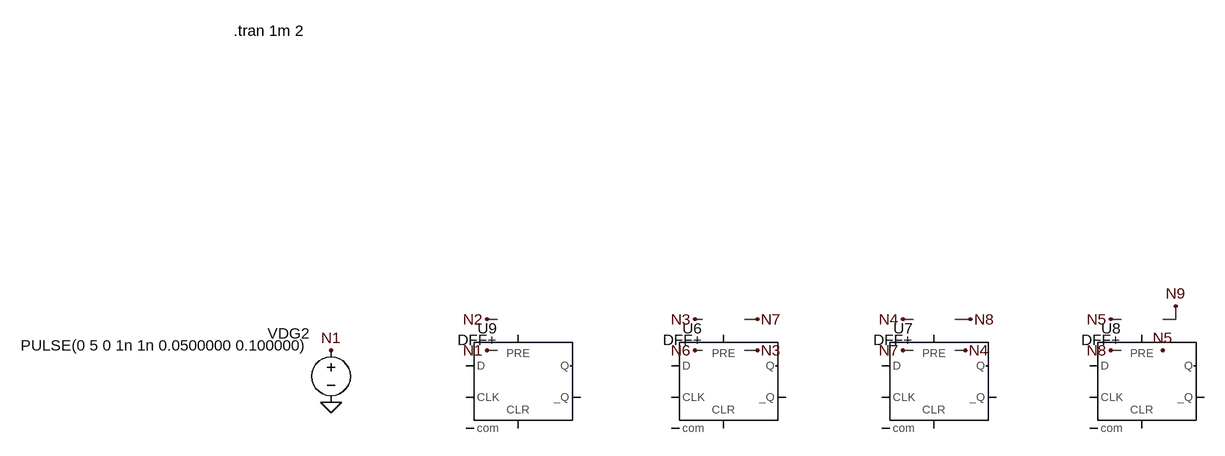
[diagram p0: schematic 6_2_1_Asynchroner_Frequenzteiler_Lsg2.asc]
6_2_1_Asynchroner_Frequenzteiler_Lsg2.asc, the LTspice schematic file:
Version 4
SHEET 1 880 680
WIRE 400 544 416 544
WIRE 816 592 796 592
WIRE 720 544 732 544
WIRE 1136 592 1120 592
WIRE 1040 544 1056 544
WIRE 1360 544 1376 544
WIRE 400 592 416 592
WIRE 720 592 732 592
WIRE 816 544 796 544
WIRE 1040 592 1056 592
WIRE 1144 544 1120 544
WIRE 1360 592 1376 592
WIRE 1440 544 1460 544
WIRE 1460 544 1460 524
FLAG 160 672 0
FLAG 400 544 N2
FLAG 816 592 N3
FLAG 720 544 N3
FLAG 1136 592 N4
FLAG 1040 544 N4
FLAG 1440 592 N5
FLAG 1360 544 N5
FLAG 160 592 N1
FLAG 400 592 N1
FLAG 720 592 N6
FLAG 816 544 N7
FLAG 1040 592 N7
FLAG 1144 544 N8
FLAG 1360 592 N8
FLAG 1460 524 N9
SYMBOL Digital\dflop 764 568 R0
WINDOW 0 -32 -10 Right 2
WINDOW 3 -32 8 Right 2
SYMATTR InstName U6
SYMATTR Value DFF+
SYMATTR LibreSpice kind=dff;edge=rising;async=high;vth=2.5;vhigh=5;pins=D,CLK,SET,RESET,Q,~Q
SYMBOL Digital\dflop 1088 568 R0
WINDOW 0 -32 -10 Right 2
WINDOW 3 -32 8 Right 2
SYMATTR InstName U7
SYMATTR Value DFF+
SYMATTR LibreSpice kind=dff;edge=rising;async=high;vth=2.5;vhigh=5;pins=D,CLK,SET,RESET,Q,~Q
SYMBOL Digital\dflop 1408 568 R0
WINDOW 0 -32 -10 Right 2
WINDOW 3 -32 8 Right 2
SYMATTR InstName U8
SYMATTR Value DFF+
SYMATTR LibreSpice kind=dff;edge=rising;async=high;vth=2.5;vhigh=5;pins=D,CLK,SET,RESET,Q,~Q
SYMBOL voltage 160 576 R0
WINDOW 0 -32 -10 Right 2
WINDOW 3 -32 8 Right 2
SYMATTR InstName VDG2
SYMATTR Value PULSE(0 5 0 1n 1n 0.0500000 0.100000)
SYMBOL Digital\dflop 448 568 R0
WINDOW 0 -32 -10 Right 2
WINDOW 3 -32 8 Right 2
SYMATTR InstName U9
SYMATTR Value DFF+
SYMATTR LibreSpice kind=dff;edge=rising;async=high;vth=2.5;vhigh=5;pins=D,CLK,SET,RESET,Q,~Q
TEXT 10 100 Left 2 !.tran 1m 2

The netlist it stands for:
* 6_2_1_Asynchroner_Frequenzteiler_Lsg2.asc
A§U6 0 0 0 0 0 0 0 0 DFLOP DFF+
A§U7 0 0 0 0 0 0 0 0 DFLOP DFF+
A§U8 0 0 0 0 0 0 0 0 DFLOP DFF+
VDG2 N1 0 PULSE(0 5 0 1n 1n 0.0500000 0.100000)
A§U9 0 0 0 0 0 0 0 0 DFLOP DFF+
.tran 1m 2
.backanno
.end